# Altium schematic sheet Brake Switch.SchDoc
size A4; SheetNumber: 1; SheetTotal: 1
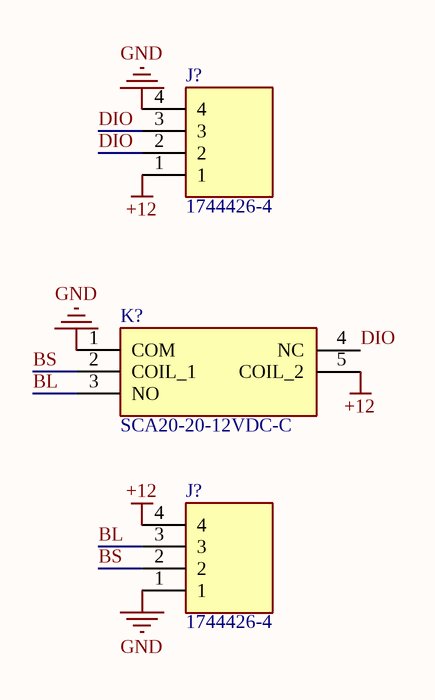
[diagram p0: Brake Switch.SchDoc]

## Parts
(Parts that share a designator on the sheet are numbered #1, #2 ... from top to bottom, then left to right.)
J?#1  1744426-4  [17444264]
J?#2  1744426-4  [17444264]
K?  SCA20-20-12VDC-C  [SCA202012VDCC]

## Nets
+12: J?#1.1 J?#2.4 K?.5(COIL_2)
GND: J?#1.4 J?#2.1 K?.1(COM)
BL: J?#2.3 K?.3(NO)
BS: J?#2.2 K?.2(COIL_1)
DIO: J?#1.2 J?#1.3 K?.4(NC)

## Library data of the parts
J?#1 J?#2 = 1744426-4: Connector; Manufacturer_Name: TE Connectivity; Datasheet Link: https://www.te.com/commerce/DocumentDelivery/DDEController?Action=showdoc&DocId=Customer+Drawing%7F1744426%7FD2%7Fpdf%7FEnglish%7FENG_CD_1744426_D2.pdf%7F1744426-4; Height: 7.8mm; Manufacturer_Part_Number: 1744426-4; Mouser Part Number: 571-1744426-4; Mouser Price/Stock: https://www.mouser.co.uk/ProductDetail/TE-Connectivity-AMP/1744426-4?qs=IGPQaF7TU6toTieyWkjyEQ%3D%3D; Arrow Part Number: 1744426-4; Arrow Price/Stock: https://www.arrow.com/en/products/1744426-4/te-connectivity?region=nac
K? = SCA20-20-12VDC-C: Relay or Contactor; Manufacturer_Name: LEONE; Datasheet Link: https://www.kuraelectronics.com/new-pdf/SCA%2020.pdf; Height: 13.7mm; Manufacturer_Part_Number: SCA20-20-12VDC-C